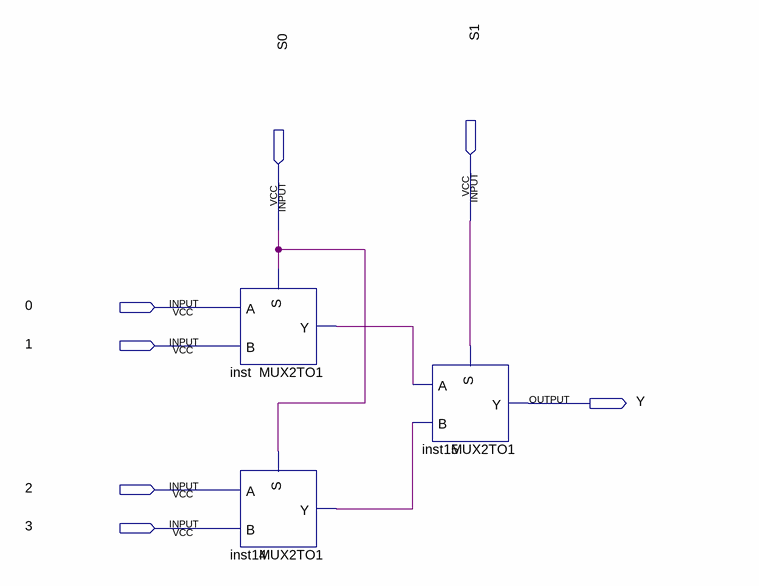
[diagram p0: schematic sheet]
// Quartus schematic MUX4TO1.bdf as structural Verilog: 3 symbols, 7 pins
module MUX4TO1 (
  input  S1,
  input  S0,
  input  \0 ,
  input  \1 ,
  input  \2 ,
  input  \3 ,
  output Y
);

  wire inst14_y, inst_y;

  MUX2TO1 inst (.S(S0), .A(\0 ), .B(\1 ), .Y(inst_y));
  MUX2TO1 inst14 (.S(S0), .A(\2 ), .B(\3 ), .Y(inst14_y));
  MUX2TO1 inst15 (.S(S1), .A(inst_y), .B(inst14_y), .Y(Y));
endmodule
